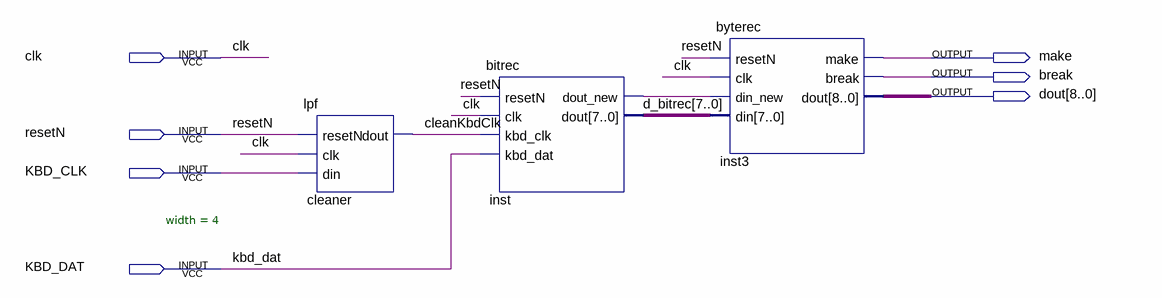
[diagram p0: schematic sheet]
// Quartus schematic KBD.bdf as structural Verilog: 3 symbols, 7 pins
module KBD (
  input  clk,
  input  resetN,
  input  KBD_CLK,
  input  KBD_DAT,
  output make,
  output \break ,
  output [8:0] dout
);

  wire cleanKbdClk, inst_dout_new;
  wire [7:0] d_bitrec;

  lpf #(.width(4)) cleaner (.resetN(resetN), .clk(clk), .din(KBD_CLK), .dout(cleanKbdClk));
  bitrec inst (
    .resetN(resetN), .clk(clk), .kbd_clk(cleanKbdClk), .kbd_dat(KBD_DAT), .dout_new(inst_dout_new),
    .dout(d_bitrec));
  byterec inst3 (
    .resetN(resetN), .clk(clk), .din_new(inst_dout_new), .din(d_bitrec), .make(make), .\break (\break ),
    .dout(dout));
endmodule
